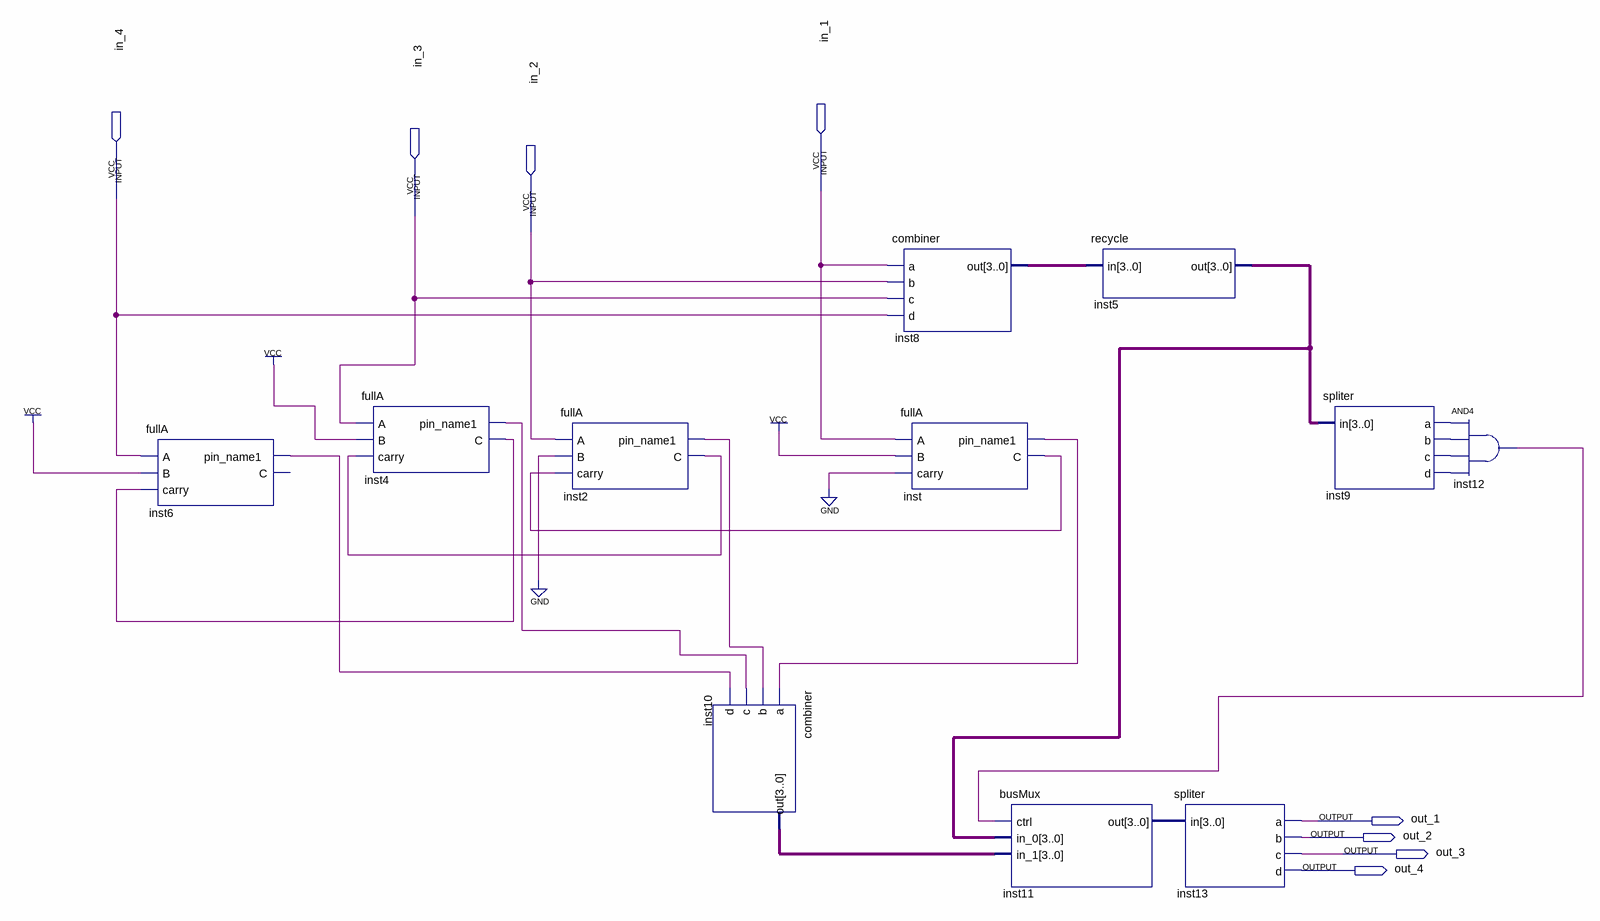
[diagram p0: schematic sheet]
// Quartus schematic subDevice.bdf as structural Verilog: 11 symbols, 8 pins
module subDevice (
  input  in_1,
  input  in_4,
  input  in_3,
  input  in_2,
  output out_1,
  output out_2,
  output out_3,
  output out_4
);

  wire inst2_c, inst2_pin_name1, inst4_c, inst4_pin_name1, inst6_pin_name1, inst9_a, inst9_b, inst9_c,
       inst9_d, inst12_out, inst_c, inst_pin_name1;
  wire [3:0] inst5_out, inst8_out, inst10_out, inst11_out;

  fullA inst6 (.A(in_4), .B(1'b1), .carry(inst4_c), .pin_name1(inst6_pin_name1));  // open: C
  fullA inst4 (.A(in_3), .B(1'b1), .carry(inst2_c), .pin_name1(inst4_pin_name1), .C(inst4_c));
  fullA inst2 (.A(in_2), .B(1'b0), .carry(inst_c), .pin_name1(inst2_pin_name1), .C(inst2_c));
  combiner inst10 (.a(inst_pin_name1), .b(inst2_pin_name1), .c(inst4_pin_name1), .d(inst6_pin_name1), .out(inst10_out));
  combiner inst8 (.a(in_1), .b(in_2), .c(in_3), .d(in_4), .out(inst8_out));
  fullA inst (.A(in_1), .B(1'b1), .carry(1'b0), .pin_name1(inst_pin_name1), .C(inst_c));
  busMux inst11 (.ctrl(inst12_out), .in_0(inst5_out), .in_1(inst10_out), .out(inst11_out));
  recycle inst5 (.in(inst8_out), .out(inst5_out));
  spliter inst13 (.in(inst11_out), .a(out_1), .b(out_2), .c(out_3), .d(out_4));
  spliter inst9 (.in(inst5_out), .a(inst9_a), .b(inst9_b), .c(inst9_c), .d(inst9_d));
  and inst12 (inst12_out, inst9_a, inst9_b, inst9_c, inst9_d);
endmodule
